# Altium schematic sheet MDQARM_USB_UART.SchDoc
size A3; Organization: Altium Limited; Address1: L3, 12a Rodborough Rd; Address2: Frenchs Forest; Address3: NSW; Address4: Australia 2086
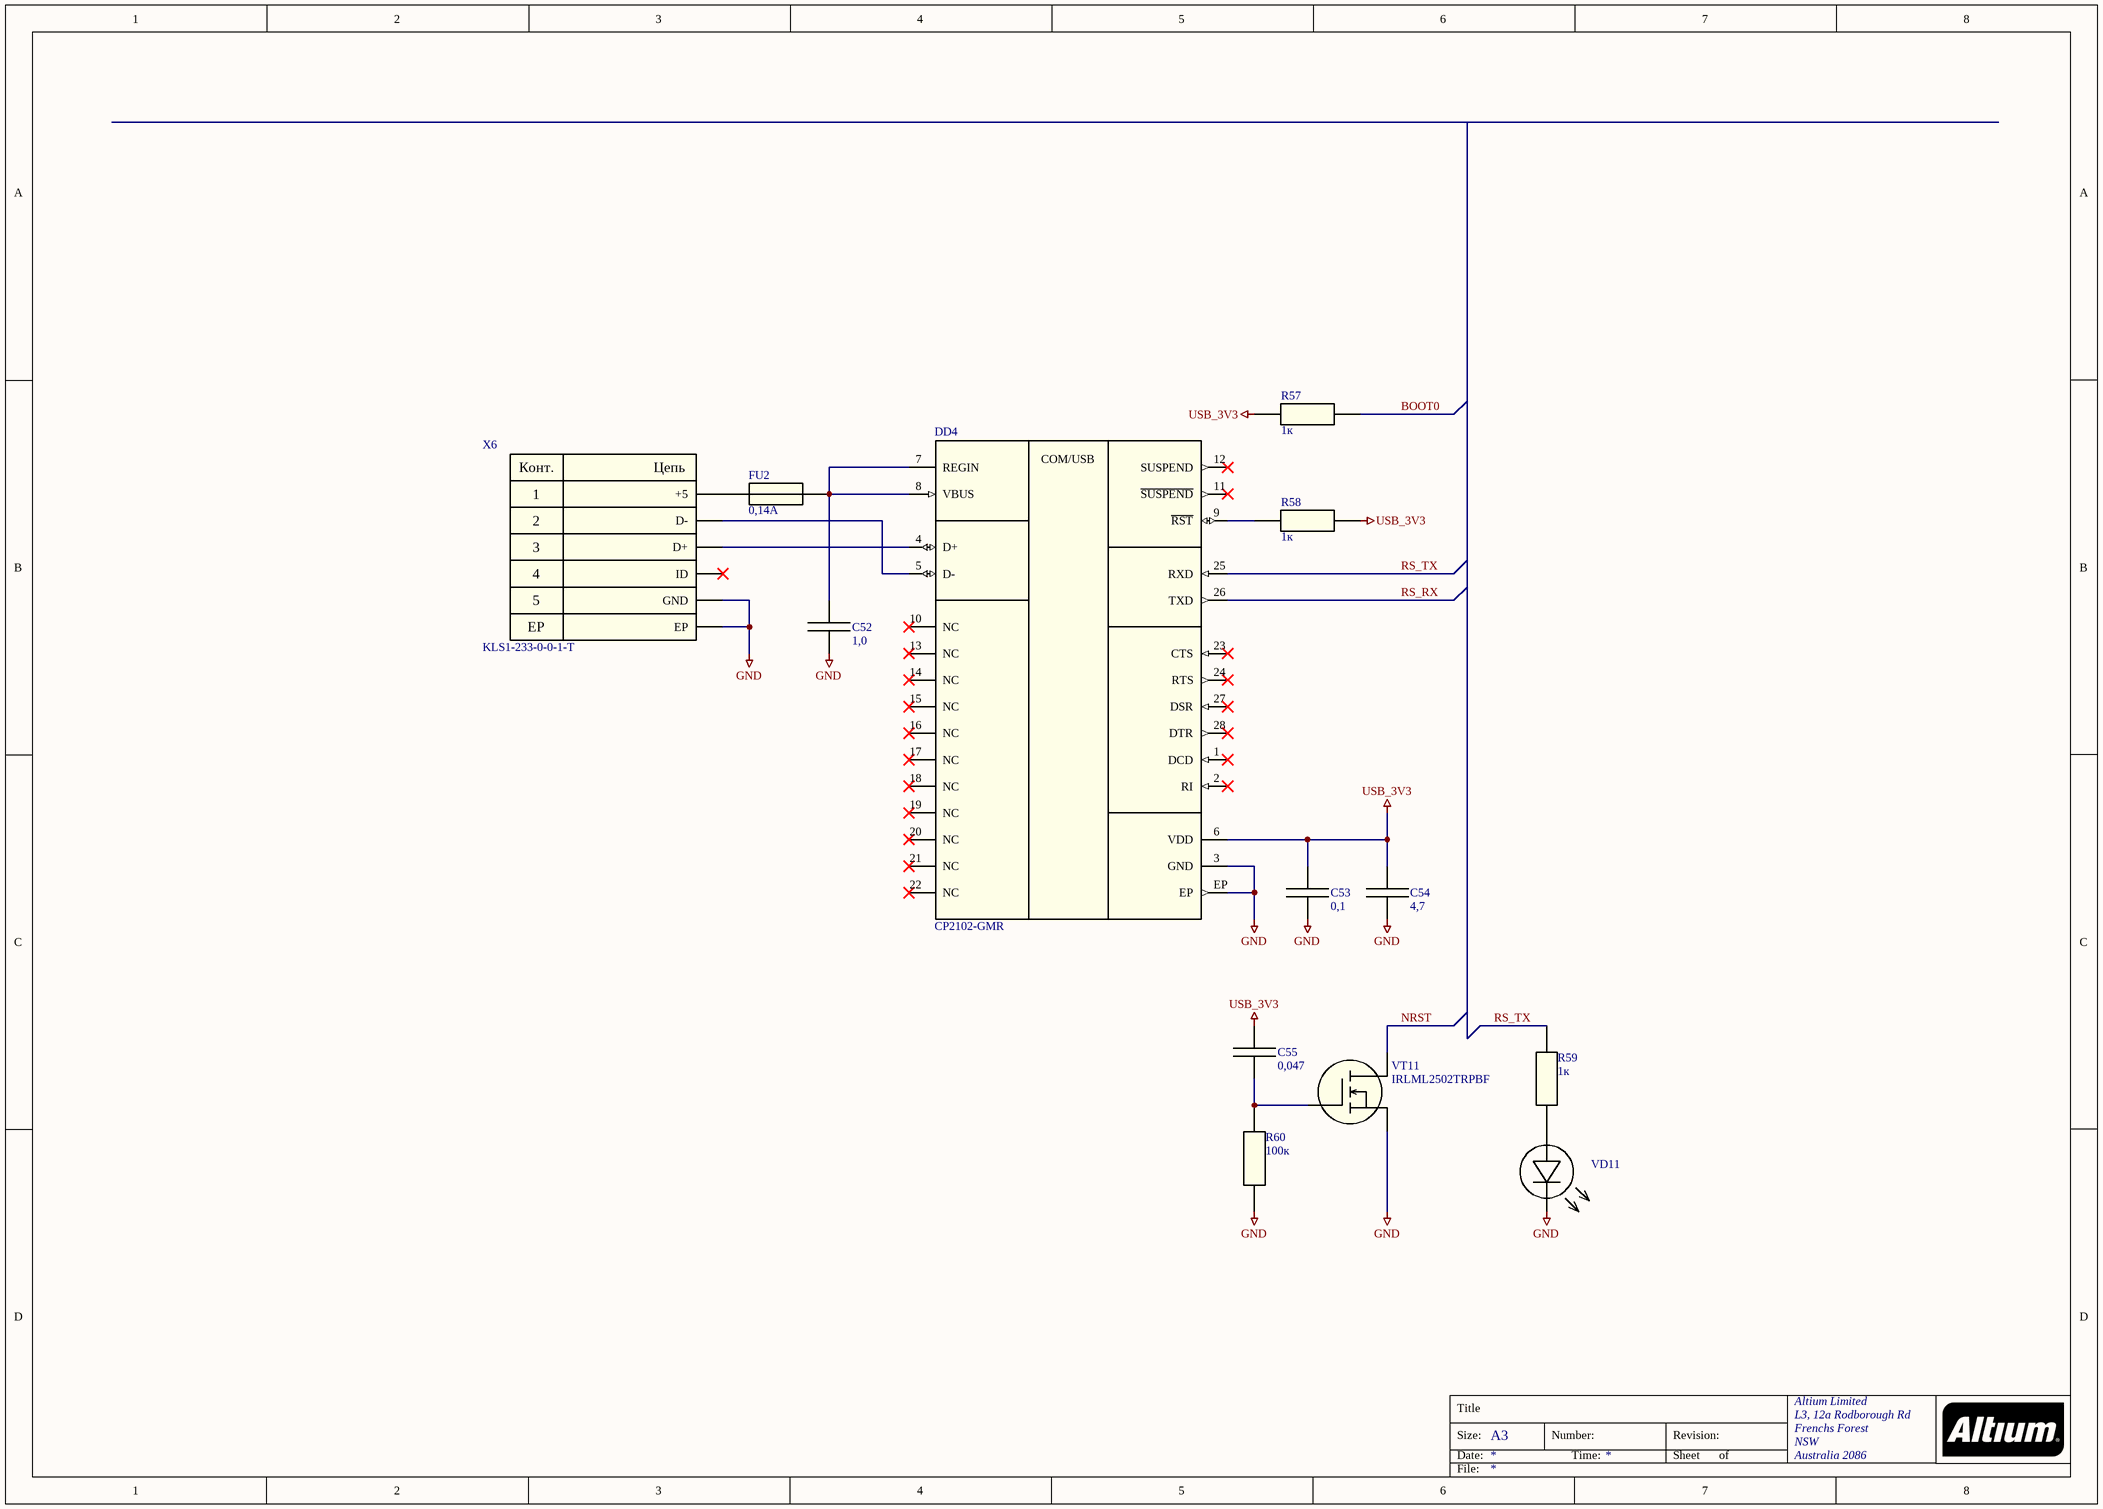
[diagram p0: MDQARM_USB_UART.SchDoc]

## Parts
C52  1,0  [Capacitor SMD0805-T1.35]
C53  0,1  [Capacitor SMD0805-T0.95]
C54  4,7  [Capacitor SMD0805-T1.35]
C55  0,047  [Capacitor SMD0805-T0.75]
DD4  CP2102-GMR  [IC CP2102-GMR]
FU2  0,14А  [Fuse MF-NSMF]
R57  1к  [Resistor SMD0805]
R58  1к  [Resistor SMD0805]
R59  1к  [Resistor SMD0805]
R60  100к  [Resistor SMD0805]
VD11  GREEN  [Diode SMD0805]  (value not drawn)
VT11  IRLML2502TRPBF  [Transistor SOT23]
X6  KLS1-233-0-0-1-T  [Connector KLS1-233-0-0-1-T]

## Nets
GND: C52.1 C53.1 C54.1 DD4.3(GND) DD4.EP R60.1 VD11.2(C) VT11.2(S) X6.5(GND) X6.EP
USB_3V3: C53.2 C54.2 C55.2 DD4.6(VDD) R57.2 R58.2
BOOT0: R57.1
NRST: VT11.3(D)
RS_RX: DD4.26(TXD)
RS_TX: DD4.25(RXD) R59.1
NetC52_2: C52.2 DD4.7(REGIN) DD4.8(VBUS) FU2.2
NetC55_1: C55.1 R60.2 VT11.1(G)
NetDD4_4: DD4.4(D+) X6.3(D+)
NetDD4_5: DD4.5(D-) X6.2(D-)
NetDD4_9: DD4.9(~{RST}) R58.1
NetFU2_1: FU2.1 X6.1(+5)
NetR59_2: R59.2 VD11.1(A)

Not connected (* = marked no-connect by the designer): DD4 1(DCD)* 2(RI)* 10(NC)* 11(~{SUSPEND})* 12(SUSPEND)* 13(NC)* 14(NC)* 15(NC)* 16(NC)* 17(NC)* 18(NC)* 19(NC)* 20(NC)* 21(NC)* 22(NC)* 23(CTS)* 24(RTS)* 27(DSR)* 28(DTR)*; X6 4(ID)*

## Notes on the sheet
- Title
- Size:
- Date:
- A3
- Number:
- Time:
- Revision:
- Sheet
- of
- File:
- (in symbol Connector KLS1-233-0-0-1-T) Конт.; Цепь
- (in symbol IC CP2102-GMR) COM/USB

## Library data of the parts
C52 = Capacitor C0805_1u: Value: 1,0
C53 = Capacitor C0805_100n: Value: 0,1
C54 = Capacitor C0805_4.7u: Value: 4,7
C55 = Capacitor C0805_47n: Value: 0,047
DD4 = IC CP2102-GMR: Value: CP2102-GMR
FU2 = Fuse MF-NSMF014-2: Value: 0,14А
R57-R59 = Resistor R0805_1k_5%: Value: 1к
R60 = Resistor R0805_100k_5%: Value: 100к
VD11 = Diode LED0805GREEN: LED Green SMD0805
VT11 = Transistor IRLML2502TRPBF: Value: IRLML2502TRPBF
X6 = Connector KLS1-233-0-0-1-T: microUSB Connector